# EAGLE design untitled (EAGLE 9.6.2)
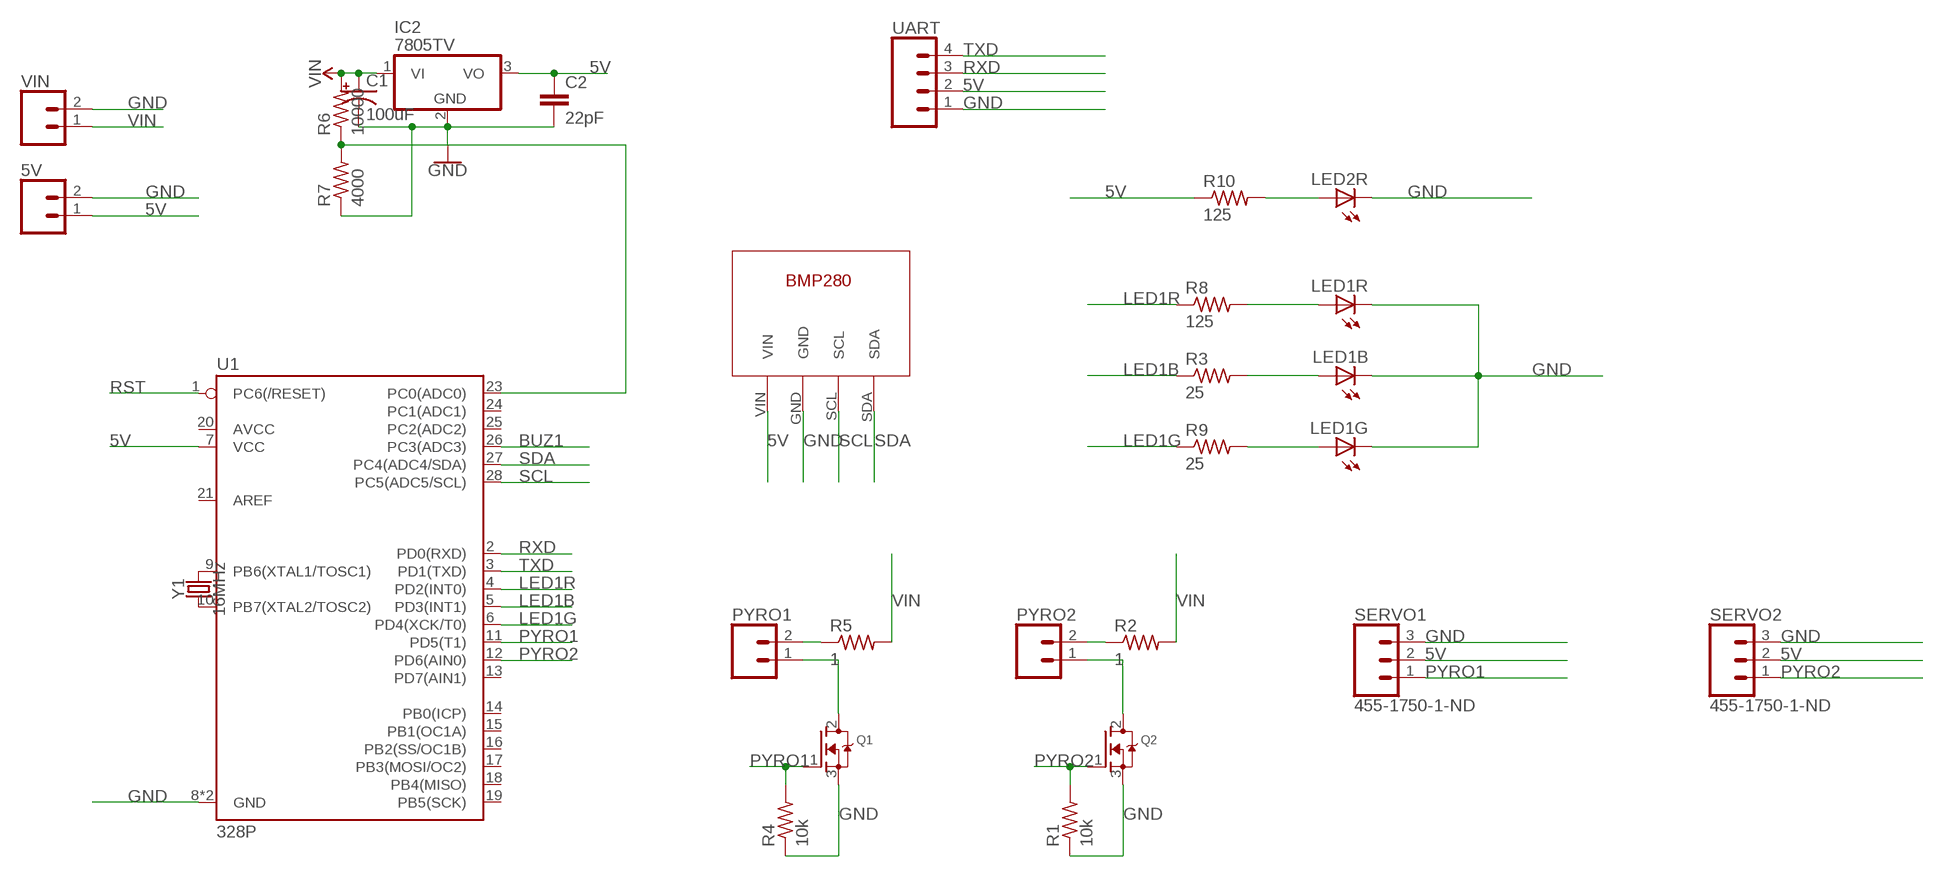
[diagram p0: schematic, sheet 1]

## Parts
5V  CONN_02  [1X02]
C1  100uF  100UF-POLAR-RADIAL-2.5MM-25V-20%  [CPOL-RADIAL-2.5MM-6.5MM]
C2  22pF  22PF-PTH-2.54MM-200V-5%  [CAP-PTH-2.54]
IC2  7805TV  [TO220V]
LED1B  LED1B  LED5MM  [LED5MM]
LED1G  LED1G  LED5MM  [LED5MM]
LED1R  LED1R  LED5MM  [LED5MM]
LED2R  LED1R  LED5MM  [LED5MM]
PYRO1  CONN_02  [1X02]
PYRO2  CONN_02  [1X02]
Q1  MOSFET-NGDS_TO220V  [TO220V]
Q2  MOSFET-NGDS_TO220V  [TO220V]
R1  10k  FLIPFLOP-RES  [0805-THM]
R2  1  FLIPFLOP-RES  [0805-THM]
R3  25  FLIPFLOP-RES  [0805-THM]
R4  10k  FLIPFLOP-RES  [0805-THM]
R5  1  FLIPFLOP-RES  [0805-THM]
R6  10000  FLIPFLOP-RES  [0805-THM]
R7  4000  FLIPFLOP-RES  [0805-THM]
R8  125  FLIPFLOP-RES  [0805-THM]
R9  25  FLIPFLOP-RES  [0805-THM]
R10  125  FLIPFLOP-RES  [0805-THM]
SERVO1  455-1750-1-ND  CONN_03  [1X03]
SERVO2  455-1750-1-ND  CONN_03  [1X03]
U1  328P  ATMEGA328P_PDIP  [DIP28]
U$1  BMP280  [BMP280]
UART  CONN_04PTH  [1X04]
VIN  CONN_02  [1X02]
Y1  16MHz  CRYSTAL-16MHZPTH-HC49US  [HC49US]

## Nets
5V: 5V.1 C2.1 IC2.3(VO) R10.1 SERVO1.2 SERVO2.2 U1.7(VCC) U$1.VIN UART.2
BUZ1: U1.26(PC3(ADC3))
GND: 5V.2 C1.2(-) C2.2 IC2.2(GND) LED1B.K(C) LED1G.K(C) LED1R.K(C) LED2R.K(C) Q1.3(S) Q2.3(S) R1.1 R4.1 R7.1 SERVO1.3 SERVO2.3 U1.8(GND) U1.22(GND) U$1.GND UART.1 VIN.2
LED1B: R3.1 U1.5(PD3(INT1))
LED1G: R9.1 U1.6(PD4(XCK/T0))
LED1R: R8.1 U1.4(PD2(INT0))
N$1: PYRO1.1 Q1.2(D)
N$2: PYRO2.1 Q2.2(D)
N$3: U1.9(PB6(XTAL1/TOSC1)) Y1.2
N$4: U1.10(PB7(XTAL2/TOSC2)) Y1.1
N$5: PYRO1.2 R5.1
N$6: R6.1 R7.2 U1.23(PC0(ADC0))
N$7: PYRO2.2 R2.1
N$8: LED1R.A R8.2
N$9: LED1B.A R3.2
N$10: LED1G.A R9.2
N$12: LED2R.A R10.2
PYRO1: Q1.1(G) R4.2 SERVO1.1 U1.11(PD5(T1))
PYRO2: Q2.1(G) R1.2 SERVO2.1 U1.12(PD6(AIN0))
RST: U1.1(PC6(/RESET))
RXD: U1.2(PD0(RXD)) UART.3
SCL: U1.28(PC5(ADC5/SCL)) U$1.SCL
SDA: U1.27(PC4(ADC4/SDA)) U$1.SDA
TXD: U1.3(PD1(TXD)) UART.4
VIN: C1.1(+) IC2.1(VI) R2.2 R5.2 R6.2 VIN.1
Unconnected: U1.13(PD7(AIN1)) U1.14(PB0(ICP)) U1.15(PB1(OC1A)) U1.16(PB2(SS/OC1B)) U1.17(PB3(MOSI/OC2)) U1.18(PB4(MISO)) U1.19(PB5(SCK)) U1.20(AVCC) U1.21(AREF) U1.24(PC1(ADC1)) U1.25(PC2(ADC2))

## Library data of the parts
5V PYRO1 PYRO2 VIN = SparkFun-Connectors:CONN_02: Multi connection point. Often used as Generic Header-pin footprint for 0.1 inch spaced/style header connections On any of the 0.1 inch spaced packages, you can populate with these: Break Away Headers - Straight <https://www.sparkfun.com/products/116> (PRT-00116) Break Away Male Headers - Right Angle <https://www.sparkfun.com/products/553> (PRT-00553) Female Headers <https://www.sparkfun.com/products/115> (PRT-00115) Break Away Headers - Machine Pin <https://www.sparkfun.com/products/117> (PRT-00117) Break Away Female Headers - Swiss Machine Pin <https://www.sparkfun.com/products/743> (PRT-00743) For SCREWTERMINALS and SPRING TERMINALS visit here: Screw Terimnals on SparkFun.com <https://www.sparkfun.com/search/results?term=Screw+Terminals> (5mm/3.5mm/2.54mm spacing) This device is also useful as a general connection point to wire up your design to another part of your project. Our various solder wires solder well into these plated through hole pads. Hook-Up Wire - Assortment (Stranded, 22 AWG) <https://www.sparkfun.com/products/11375> (PRT-11375) Hook-Up Wire - Assortment (Solid Core, 22 AWG) <https://www.sparkfun.com/products/11367> (PRT-11367) View the entire wire category on our website here <https://www.sparkfun.com/categories/141> Special notes: Molex polarized connector foot print use with: PRT-08233 with associated crimp pins and housings. 2.54_SCREWTERM for use with PRT-10571. 3.5mm Screw Terminal footprints for PRT-08084 5mm Screw Terminal footprints for use with PRT-08432
C1 = SparkFun-Capacitors:100UF-POLAR: 100µF polarized capacitors A capacitor is a passive two-terminal electrical component used to store electrical energy temporarily in an electric field.; PROD_ID: CAP-08439
C2 = SparkFun-Capacitors:22PF: 22pF ceramic capacitors A capacitor is a passive two-terminal electrical component used to store electrical energy temporarily in an electric field.; PROD_ID: CAP-09128
IC2 = linear:78*: Positive VOLTAGE REGULATOR Source: http://cache.national.com/ds/LM/LM78L05.pdf http://www.fairchildsemi.com/ds/LM/LM7805.pdf
LED1B LED1G LED1R LED2R = adafruit:LED: LED OSRAM: - CHIPLED LG R971, LG N971, LY N971, LG Q971, LY Q971, LO R971, LY R971 LH N974, LH R974 LS Q976, LO Q976, LY Q976 LO Q996 - Hyper CHIPLED LW Q18S LB Q993, LB Q99A, LB R99A - SideLED LS A670, LO A670, LY A670, LG A670, LP A670 LB A673, LV A673, LT A673, LW A673 LH A674 LY A675 LS A676, LA A676, LO A676, LY A676, LW A676 LS A679, LY A679, LG A679 - Hyper Micro SIDELED® LS Y876, LA Y876, LO Y876, LY Y876 LT Y87S - SmartLED LW L88C, LW L88S LB L89C, LB L89S, LG L890 LS L89K, LO L89K, LY L89K LS L896, LA L896, LO L896, LY L896 - TOPLED LS T670, LO T670, LY T670, LG T670, LP T670 LSG T670, LSP T670, LSY T670, LOP T670, LYG T670 LG T671, LOG T671, LSG T671 LB T673, LV T673, LT T673, LW T673 LH T674 LS T676, LA T676, LO T676, LY T676, LB T676, LH T676, LSB T676, LW T676 LB T67C, LV T67C, LT T67C, LS T67K, LO T67K, LY T67K, LW E67C LS E67B, LA E67B, LO E67B, LY E67B, LB E67C, LV E67C, LT E67C LW T67C LS T679, LY T679, LG T679 LS T770, LO T770, LY T770, LG T770, LP T770 LB T773, LV T773, LT T773, LW T773 LH T774 LS E675, LA E675, LY E675, LS T675 LS T776, LA T776, LO T776, LY T776, LB T776 LHGB T686 LT T68C, LB T68C - Hyper Mini TOPLED® LB M676 - Mini TOPLED Santana® LG M470 LS M47K, LO M47K, LY M47K Source: http://www.osram.convergy.de/
Q1 Q2 = adafruit:MOSFET-N: N-Channel Mosfet 2N7002E - 60V 260mA SOT23 [Digikey: 2N7002ET1GOSTR-ND] - REEL BSH103 - 30V 850mA SOT23 [Digikey: 568-5013-1-ND]
R1-R10 = adafruit:FLIPFLOP-RES: Flip Flop resistor An 0805 resistor inside a standard 1/4W 5% resistor. Makes for easy mods
SERVO1 SERVO2 = SparkFun-Connectors:CONN_03: Multi connection point. Often used as Generic Header-pin footprint for 0.1 inch spaced/style header connections On any of the 0.1 inch spaced packages, you can populate with these: Break Away Headers - Straight <https://www.sparkfun.com/products/116> (PRT-00116) Break Away Male Headers - Right Angle <https://www.sparkfun.com/products/553> (PRT-00553) Female Headers <https://www.sparkfun.com/products/115> (PRT-00115) Break Away Headers - Machine Pin <https://www.sparkfun.com/products/117> (PRT-00117) Break Away Female Headers - Swiss Machine Pin <https://www.sparkfun.com/products/743> (PRT-00743) Stackable Header - 3 Pin (Female, 0.1") <https://www.sparkfun.com/products/13875> (PRT-13875) For SCREWTERMINALS and SPRING TERMINALS visit here: Screw Terimnals on SparkFun.com <https://www.sparkfun.com/search/results?term=Screw+Terminals> (5mm/3.5mm/2.54mm spacing) This device is also useful as a general connection point to wire up your design to another part of your project. Our various solder wires solder well into these plated through hole pads. Hook-Up Wire - Assortment (Stranded, 22 AWG) <https://www.sparkfun.com/products/11375> (PRT-11375) Hook-Up Wire - Assortment (Solid Core, 22 AWG) <https://www.sparkfun.com/products/11367> (PRT-11367) View the entire wire category on our website here <https://www.sparkfun.com/categories/141> Special notes: Molex polarized connector foot print use with SKU : PRT-08232 with associated crimp pins and housings.; PROD_ID: XXX-00000
U1 = SparkFun-IC-Microcontroller:ATMEGA328P_PDIP: Atmel 328P Through hole ATMEGA328P uC used in the Arduino 32kb flash, 1k EEPROM, 2k SRAM Datasheet <http://www.sparkfun.com/datasheets/Components/SMD/ATMega328.pdf> SparkFun Products Storefront component: AVR 28 Pin 20MHz 32K 6A/D - ATMega328P <https://www.sparkfun.com/products/9061> (COM-09061) SparkFun Simon Says - Through-Hole Soldering Kit <https://www.sparkfun.com/products/10547> (KIT-10547) SparkFun Learn to Solder - Simon Says <https://www.sparkfun.com/products/13708> (KIT-13708) SparkFun BigTime Watch Kit <https://www.sparkfun.com/products/11734> (KIT-11734) SparkFun ClockIt <https://www.sparkfun.com/products/10930> (KIT-10930) SparkFun Serial Enabled LCD Kit <https://www.sparkfun.com/products/10097> (LCD-10097) SparkFun Simon Tilts - Through Hole Soldering Kit <https://www.sparkfun.com/products/12634> (KIT-12634) SparkFun Frequency Counter Kit <https://www.sparkfun.com/products/10140> (KIT-10140) FabFM Radio Kit <https://www.sparkfun.com/products/11043> (KIT-11043) SparkFun Binary Blaster Kit <https://www.sparkfun.com/products/12037> (KIT-12037) SparkFun Metro-Gnome <https://www.sparkfun.com/products/9236> (KIT-09236) ATmega328 with Arduino Optiboot (Uno) <https://www.sparkfun.com/products/10524> (DEV-10524); PROD_ID: IC-09136
U$1 = bmp280:BMP280
UART = SparkFun-Connectors:CONN_04: Multi connection point. Often used as Generic Header-pin footprint for 0.1 inch spaced/style header connections On any of the 0.1 inch spaced packages, you can populate with these: Break Away Headers - Straight <https://www.sparkfun.com/products/116> (PRT-00116) Break Away Male Headers - Right Angle <https://www.sparkfun.com/products/553> (PRT-00553) Female Headers <https://www.sparkfun.com/products/115> (PRT-00115) Break Away Headers - Machine Pin <https://www.sparkfun.com/products/117> (PRT-00117) Break Away Female Headers - Swiss Machine Pin <https://www.sparkfun.com/products/743> (PRT-00743) For SCREWTERMINALS and SPRING TERMINALS visit here: Screw Terimnals on SparkFun.com <https://www.sparkfun.com/search/results?term=Screw+Terminals> (5mm/3.5mm/2.54mm spacing) This device is also useful as a general connection point to wire up your design to another part of your project. Our various solder wires solder well into these plated through hole pads. Hook-Up Wire - Assortment (Stranded, 22 AWG) <https://www.sparkfun.com/products/11375> (PRT-11375) Hook-Up Wire - Assortment (Solid Core, 22 AWG) <https://www.sparkfun.com/products/11367> (PRT-11367) View the entire wire category on our website here <https://www.sparkfun.com/categories/141> Special notes: Molex polarized connector foot print use with SKU : PRT-08231 with associated crimp pins and housings. 1MM SMD Version SKU: PRT-10208; PROD_ID: CONN-09696
Y1 = SparkFun-Clocks:CRYSTAL-16MHZ: 16MHz Crystal Digikey Example <http://www.digikey.com/product-search/en?keywords=535-9122-1-ND> Frequency: 16MHz Frequency Stability: ±50ppm Frequency Tolerance: ±20ppm Load Capacitance: 18pF SparkFun Products: Pro Micro -5V/16MHz <https://www.sparkfun.com/products/12640> SparkFun Serial Enabled LCD Kit <https://www.sparkfun.com/products/10097>; PROD_ID: XTAL-08181; SF_ID: COM-00536

## Net classes
0 default: width 0.75 mm

## Board
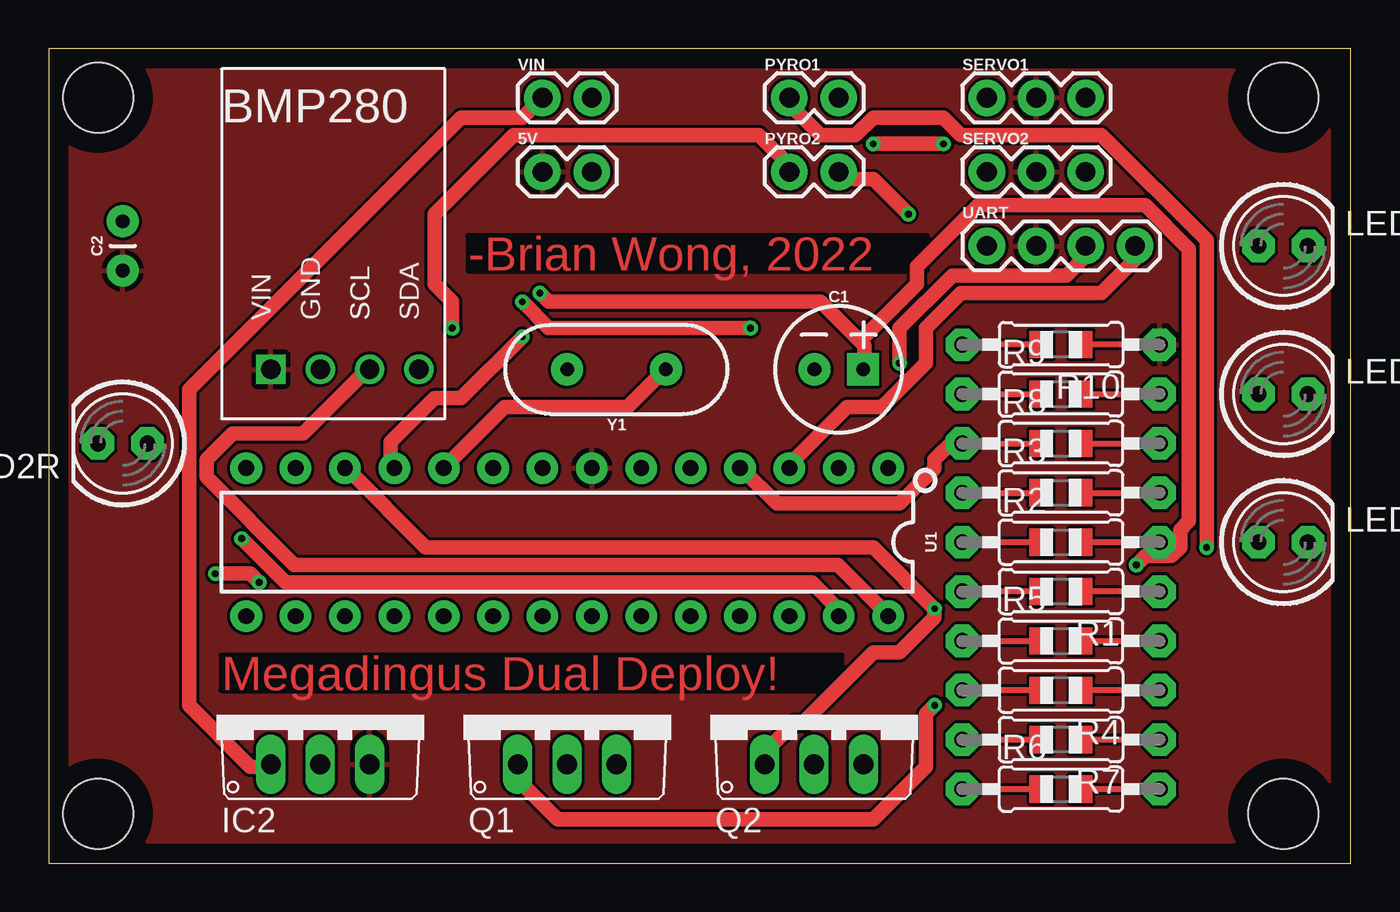
[diagram p1: board, top side]
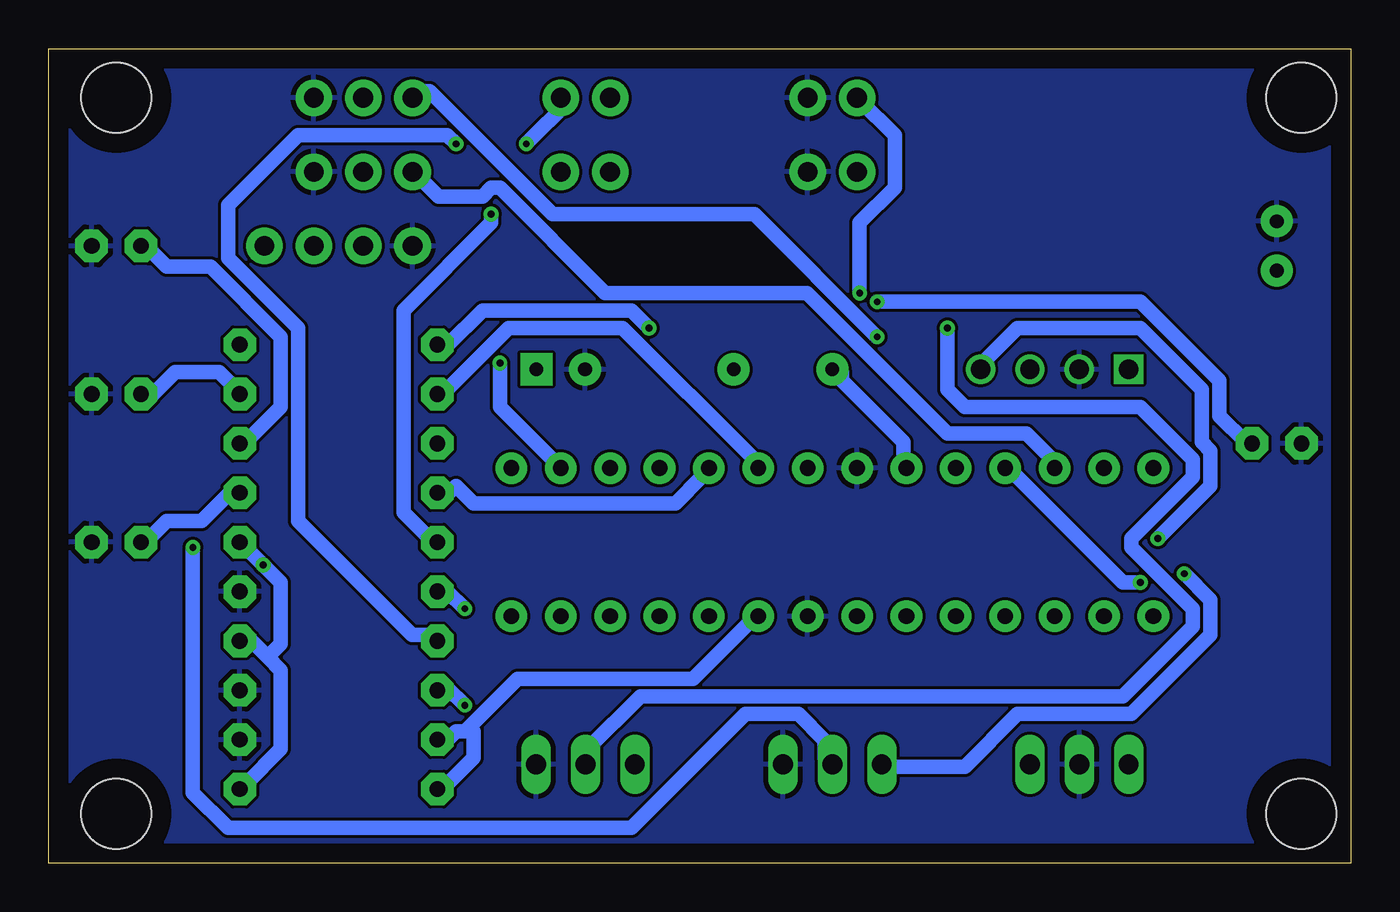
[diagram p2: board, bottom side, seen from below]

Size 66.98 x 41.9 mm. Coordinates in mm from the lower left corner, seen from the top.
Outline: 0,0 66.98,0 66.98,41.9 0,41.9 0,0
Copper layers (1*16): Top 0.035mm / dielectric 1.5mm / Bottom 0.035mm
Design rules "default": minimum track width 6mil, minimum drill 0.35mm, track to track 6mil, track to pad 6mil, pad to pad 6mil, via to via 6mil, smd to smd 6mil, copper to edge 40mil, drill to drill 6mil, minimum pad ring 10mil, minimum via ring 8mil, stop-mask expansion 4mil, vias tented up to drill 0mil, thermal gap 10mil
Holes 3.6 mm at 2.54,39.37 2.54,2.54 63.5,2.54 63.5,39.37

### Footprints (pad centres in the part's own frame; a part is rotated, then mirrored left to right if it is on the bottom)
1X02 = drill 1.016 pad 1.88: 1 0,0; 2 2.54,0
CPOL-RADIAL-2.5MM-6.5MM = drill 0.7 pad 1.651 square: 1 1.25,0 | drill 0.7 pad 1.651: 2 -1.25,0
CAP-PTH-2.54 = drill 0.7 pad 1.651: 1 -1.27,0; 2 1.27,0
TO220V = drill 1.016 long: 1 -2.54,-2.54; 2 0,-2.54; 3 2.54,-2.54
LED5MM = drill 0.813 pad 1.676 octagon: A -1.27,0; K 1.27,0
0805-THM = drill 0.813 pad 1.676 octagon: 1 -5.08,0; 2 5.08,0
1X03 = drill 1.016 pad 1.88: 1 0,0; 2 2.54,0; 3 5.08,0
DIP28 = drill 0.813 pad 1.626: 1 -16.51,-3.81; 2 -13.97,-3.81; 3 -11.43,-3.81; 4 -8.89,-3.81; 5 -6.35,-3.81; 6 -3.81,-3.81; 7 -1.27,-3.81; 8 1.27,-3.81; 9 3.81,-3.81; 10 6.35,-3.81; 11 8.89,-3.81; 12 11.43,-3.81; 13 13.97,-3.81; 14 16.51,-3.81; 15 16.51,3.81; 16 13.97,3.81; 17 11.43,3.81; 18 8.89,3.81; 19 6.35,3.81; 20 3.81,3.81; 21 1.27,3.81; 22 -1.27,3.81; 23 -3.81,3.81; 24 -6.35,3.81; 25 -8.89,3.81; 26 -11.43,3.81; 27 -13.97,3.81; 28 -16.51,3.81
BMP280 = drill 1: GND 5.08,2.54; SCL 7.62,2.54; SDA 10.16,2.54 | drill 1 square: VIN 2.54,2.54
1X04 = drill 1.016 pad 1.88: 1 0,0; 2 2.54,0; 3 5.08,0; 4 7.62,0
HC49US = drill 0.7 pad 1.651: 1 -2.54,0; 2 2.54,0

### Placement (x,y rotation side)
5V  25.4,35.56 0 top
C1  40.64,25.4 0 top
C2  3.81,31.75 90 top
IC2  13.97,7.62 0 top
LED1B  63.5,16.51 0 top
LED1G  63.5,24.13 0 top
LED1R  63.5,31.75 0 top
LED2R  3.81,21.59 180 top
PYRO1  38.1,39.37 0 top
PYRO2  38.1,35.56 0 top
Q1  26.67,7.62 0 top
Q2  39.37,7.62 0 top
R1  52.07,13.97 180 top
R2  52.07,16.51 0 top
R3  52.07,19.05 0 top
R4  52.07,8.89 180 top
R5  52.07,11.43 0 top
R6  52.07,3.81 0 top
R7  52.07,6.35 180 top
R8  52.07,21.59 0 top
R9  52.07,24.13 0 top
R10  52.07,26.67 180 top
SERVO1  48.26,39.37 0 top
SERVO2  48.26,35.56 0 top
U1  26.67,16.51 180 top
U$1  8.89,22.86 0 top
UART  48.26,31.75 0 top
VIN  25.4,39.37 0 top
Y1  29.21,25.4 180 top

### Tracks (layer width: path | path; a pad name or v marks a point on that pad's centre or on a via)
5V
  pour Top: -10.16,49.53 -10.16,-1.27 -2.54,-8.89 62.23,-8.89 74.93,3.81 74.93,45.72 69.85,50.8 -8.89,50.8
GND
  pour Bottom: -5.08,49.53 -6.35,48.26 -6.35,-11.43 72.39,-11.43 72.39,40.64 66.04,46.99 63.5,49.53
LED1B
  Bottom 0.75: U1.5 33.39,20.3 33.39,19.85 34.74,18.5 45.12,18.5 46.02,19.4 46.47,18.95 46.92,18.95 R3.1
LED1G
  Bottom 0.75: U1.6 30.68,20.75 37.45,27.52 43.31,27.52 46.92,23.91 R9.1
LED1R
  Top 0.75: U1.4 35.65,20.3 37.45,18.5 43.77,18.5 45.57,20.3 45.57,20.75 46.47,21.66 46.92,21.21 R8.1
N$1  (via drill 0.35)
  Top 0.75: v59.56,16.24 59.56,32.03 54.14,37.45 46.92,37.45 46.02,38.35 42.41,38.35 41.51,37.45 39.71,37.45 37.9,39.25 PYRO1.1
  Bottom 0.75: v59.56,16.24 59.56,3.61 57.75,1.8 37,1.8 31.13,7.67 28.43,7.67 27.07,6.32 27.07,5.41 Q1.2
N$2  (via drill 0.35)
  Top 0.75: v20.75,27.52 20.75,28.88 19.85,29.78 19.85,33.39 23.91,37.45 36.55,37.45 38.35,35.65 PYRO2.1
  Bottom 0.75: v20.75,27.52 20.75,24.36 19.85,23.46 10.83,23.46 8.12,20.75 8.12,19.85 11.28,16.69 11.28,16.24 8.12,13.09 8.12,12.18 11.73,8.57 36.55,8.57 39.25,5.87 39.25,5.41 Q2.2
N$3
  Bottom 0.75: U1.9 23.01,20.75 23.01,21.66 26.17,24.82 26.17,25.27 26.62,25.72 Y1.2
N$4
  Top 0.75: U1.10 23.46,23.46 29.78,23.46 31.58,25.27 Y1.1
N$5  (via drill 0.35)
  Top 0.75: v42.41,37 v46.02,37
  Bottom 0.75: v46.02,37 46.47,37.45 54.14,37.45 57.75,33.84 57.75,31.13 54.14,27.52 54.14,17.6 48.28,11.73 47.38,11.73 R5.1 | v42.41,37 40.16,39.25 40.61,39.71 PYRO1.2
N$6
  Bottom 0.75: 45.35,6.99 45.57,6.77 46.02,6.77 46.47,6.32 46.92,6.32 R7.2 | 45.35,6.99 42.86,9.47 33.84,9.47 30.68,12.63 U1.23 | R6.1 46.92,4.06 46.47,4.06 45.12,5.41 45.12,6.77 45.35,6.99
N$7  (via drill 0.35)
  Top 0.75: v44.22,33.39 42.41,35.19 41.06,35.19 PYRO2.2
  Bottom 0.75: v44.22,33.39 44.22,32.94 48.73,28.43 48.73,18.05 47.38,16.69 R2.1
N$8
  Bottom 0.75: R8.2 56.85,21.66 55.05,23.46 55.05,27.07 58.66,30.68 60.91,30.68 61.81,31.58 LED1R.A
N$9
  Bottom 0.75: R3.2 57.3,18.95 57.75,18.95 59.11,17.6 60.91,17.6 61.81,16.69 LED1B.A
N$10
  Bottom 0.75: R9.2 57.3,24.36 58.2,25.27 60.46,25.27 61.81,23.91 LED1G.A
N$12  (via drill 0.35)
  Top 0.75: v24.36,28.88 25.72,27.52 v36.1,27.52
  Bottom 0.75: v24.36,28.88 10.83,28.88 6.77,24.82 6.77,23.01 5.41,21.66 LED2R.A | v36.1,27.52 37,28.43 44.67,28.43 46.47,26.62 46.92,26.62 R10.2
PYRO1  (via drill 0.35)
  Top 0.75: v45.57,8.12 45.12,7.67 45.12,4.96 42.41,2.26 26.17,2.26 24.36,4.06 24.36,4.96 Q1.1 | v24.36,27.07 21.21,23.91 19.85,23.91 17.6,21.66 17.6,20.75 U1.11 | v8.57,14.89 10.38,14.89 v10.83,14.44
  Bottom 0.75: v45.57,8.12 46.47,9.02 46.92,9.02 R4.2 | v24.36,27.07 30.68,33.39 41.06,33.39 47.38,39.71 47.83,39.71 SERVO1.1 | v8.57,14.89 7.22,13.54 7.22,11.73 11.28,7.67 17.15,7.67 19.85,4.96 23.91,4.96 Q1.1 | v10.83,14.44 11.73,14.44 17.6,20.3 U1.11
PYRO2  (via drill 0.35)
  Top 0.75: Q2.1 37,5.41 37,5.87 38.35,7.22 38.8,7.22 42.41,10.83 43.77,10.83 45.57,12.63 v45.57,13.09 42.41,16.24 19.4,16.24 15.34,20.3 U1.12
  Bottom 0.75: v45.57,13.09 46.47,13.99 46.92,13.99 R1.2 | SERVO2.1 47.83,35.19 46.92,34.29 44.67,34.29 44.22,34.74 43.77,34.74 38.35,29.33 27.97,29.33 20.75,22.11 16.69,22.11 15.34,20.75 U1.12
RXD  (via drill 0.35)
  Top 0.75: v43.77,25.72 43.77,27.52 46.47,30.23 52.34,30.23 53.69,31.58 UART.3
  Bottom 0.75: v43.77,25.72 43.77,23.46 41.06,20.75 U1.2
SCL
  Top 0.75: U$1.SCL 16.24,25.27 13.09,22.11 9.47,22.11 8.12,20.75 8.12,19.85 12.63,15.34 40.61,15.34 42.86,13.09 U1.28
SDA  (via drill 0.35)
  Top 0.75: v9.93,16.69 12.18,14.44 39.25,14.44 40.61,13.09 U1.27
  Bottom 0.75: v9.93,16.69 7.22,19.4 7.22,21.21 7.67,21.66 7.67,24.36 10.83,27.52 17.15,27.52 18.95,25.72 U$1.SDA
TXD
  Top 0.75: U1.3 38.35,20.75 41.06,23.46 42.86,23.46 45.12,25.72 45.12,27.52 46.92,29.33 54.14,29.33 56.4,31.58 55.95,32.03 UART.4
VIN  (via drill 0.35)
  Top 0.75: IC2.1 11.28,4.96 10.38,4.96 7.22,8.12 7.22,24.36 21.21,38.35 24.36,38.35 25.27,39.25 VIN.1 | 41.74,26.85 39.71,28.88 25.72,28.88 v25.27,29.33 | 41.74,26.85 41.96,26.62 41.96,25.72 C1.1 | v55.95,15.34 56.4,15.79 57.75,15.79 58.2,16.24 58.2,17.15 58.66,17.6 58.66,31.58 56.4,33.84 47.83,33.84 44.67,30.68 44.67,29.78 41.74,26.85
  Bottom 0.75: 55.72,10.6 56.85,11.73 R5.2 | 55.72,10.6 55.05,9.93 55.05,5.87 56.85,4.06 R6.2 | 55.72,10.6 55.05,11.28 55.05,14.44 v55.95,15.34 56.85,16.24 R2.2 | v25.27,29.33 25.27,32.94 23.46,34.74 23.46,37.45 25.27,39.25 VIN.1

### Text on the board
Top: -Brian Wong, 2022 | Megadingus Dual Deploy!